# Altium schematic sheet CP2526_TOUCH.SchDoc
size A4
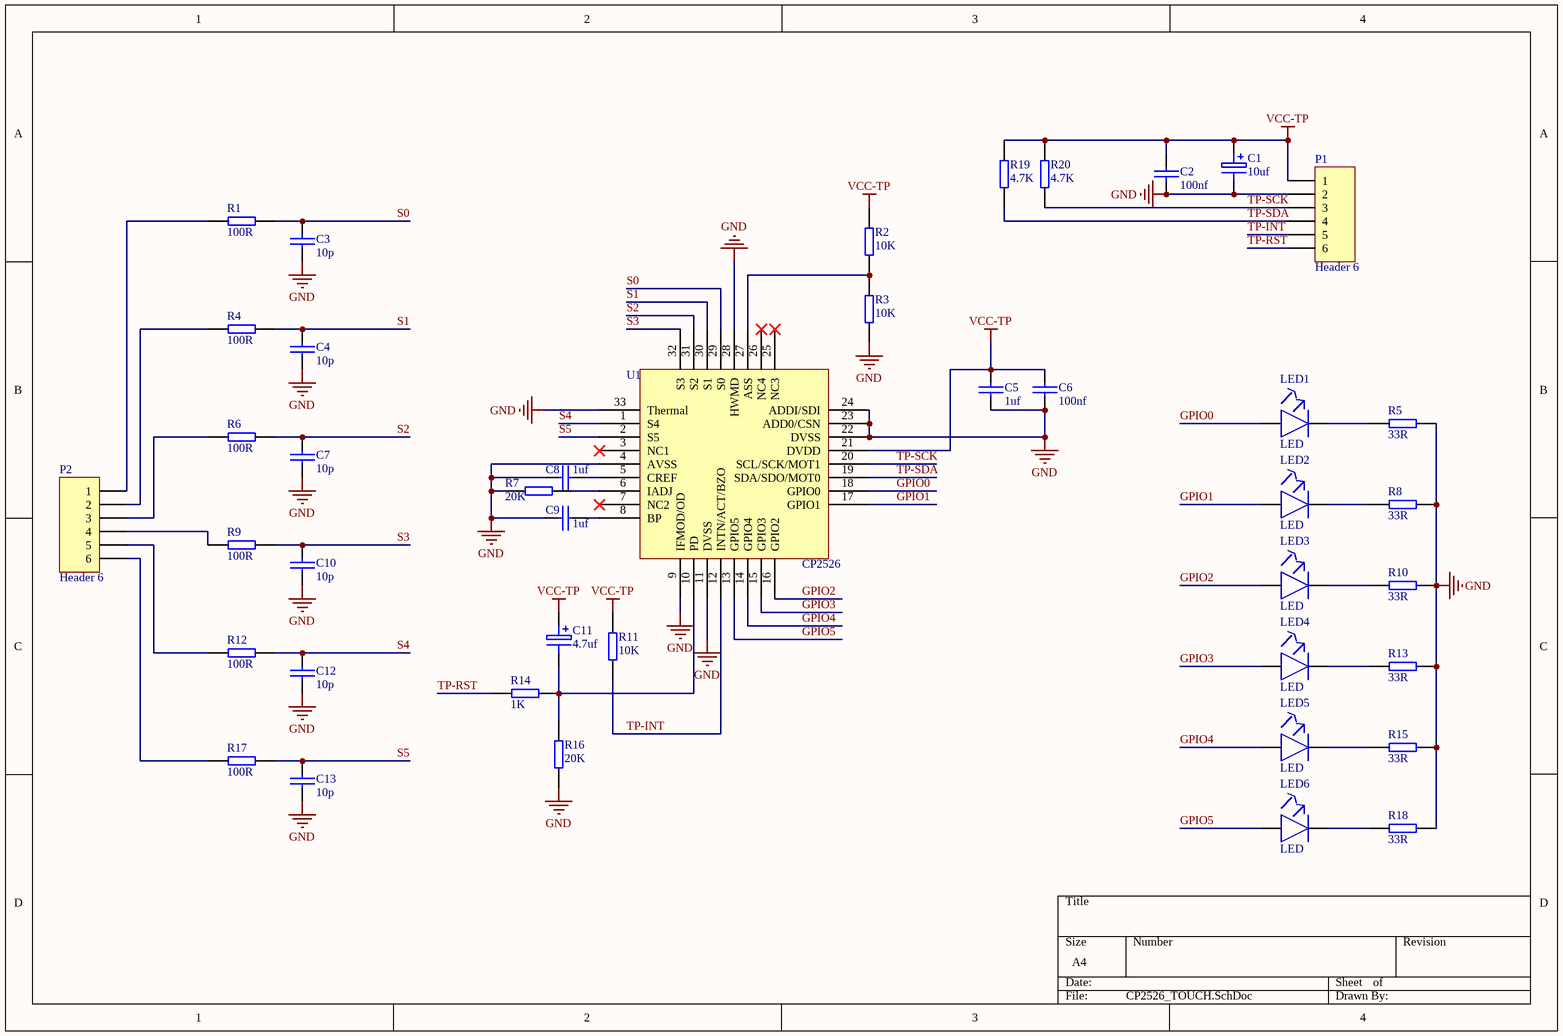
[diagram p0: CP2526_TOUCH.SchDoc]

## Parts
C1  10uf  [1206-C]
C2  100nf  [0603]
C3  10p  [0603]
C4  10p  [0603]
C5  1uf  [0603]
C6  100nf  [0603]
C7  10p  [0603]
C8  1uf  [0603]
C9  1uf  [0603]
C10  10p  [0603]
C11  4.7uf  [1206-C]
C12  10p  [0603]
C13  10p  [0603]
LED1  LED  [0603]
LED2  LED  [0603]
LED3  LED  [0603]
LED4  LED  [0603]
LED5  LED  [0603]
LED6  LED  [0603]
P1  Header 6  [HDR1X6]
P2  Header 6  [HDR1X6]
R1  100R  [0603]
R2  10K  [0603]
R3  10K  [0603]
R4  100R  [0603]
R5  33R  [0603]
R6  100R  [0603]
R7  20K  [0603]
R8  33R  [0603]
R9  100R  [0603]
R10  33R  [0603]
R11  10K  [0603]
R12  100R  [0603]
R13  33R  [0603]
R14  1K  [0603]
R15  33R  [0603]
R16  20K  [0603]
R17  100R  [0603]
R18  33R  [0603]
R19  4.7K  [0603]
R20  4.7K  [0603]
U1  CP2526  [LQFP32]

## Nets
GND: C1.2 C2.2 C3.2 C4.2 C5.2 C6.2 C7.2 C8.1 C9.1 C10.2 C12.2 C13.2 P1.2 R3.1 R5.2 R7.1 R8.2 R10.2 R13.2 R15.2 R16.1 R18.2 U1.4(AVSS) U1.9(IFMOD/OD) U1.11(DVSS) U1.22(DVSS) U1.23(ADD0/CSN) U1.24(ADDI/SDI) U1.28(HWMD) U1.33(Thermal)
VCC-TP: C1.1 C2.1 C5.1 C6.1 C11.1 P1.1 R2.2 R11.2 R19.2 R20.2 U1.21(DVDD)
GPIO0: LED1.1(+) U1.18(GPIO0)
GPIO1: LED2.1(+) U1.17(GPIO1)
GPIO2: LED3.1(+) U1.16(GPIO2)
GPIO3: LED4.1(+) U1.15(GPIO3)
GPIO4: LED5.1(+) U1.14(GPIO4)
GPIO5: LED6.1(+) U1.13(GPIO5)
S0: C3.1 R1.2 U1.29(S0)
S1: C4.1 R4.2 U1.30(S1)
S2: C7.1 R6.2 U1.31(S2)
S3: C10.1 R9.2 U1.32(S3)
S4: C12.1 R12.2 U1.1(S4)
S5: C13.1 R17.2 U1.2(S5)
TP-INT: P1.5 R11.1 U1.12(INTN/ACT/BZO)
TP-RST: P1.6 R14.1
TP-SCK: P1.3 R20.1 U1.20(SCL/SCK/MOT1)
TP-SDA: P1.4 R19.1 U1.19(SDA/SDO/MOT0)
NetC8_2: C8.2 U1.5(CREF)
NetC9_2: C9.2 U1.8(BP)
NetC11_2: C11.2 R14.2 R16.2 U1.10(PD)
NetLED1_2: LED1.2(-) R5.1
NetLED2_2: LED2.2(-) R8.1
NetLED3_2: LED3.2(-) R10.1
NetLED4_2: LED4.2(-) R13.1
NetLED5_2: LED5.2(-) R15.1
NetLED6_2: LED6.2(-) R18.1
NetP2_1: P2.1 R1.1
NetP2_2: P2.2 R4.1
NetP2_3: P2.3 R6.1
NetP2_4: P2.4 R9.1
NetP2_5: P2.5 R12.1
NetP2_6: P2.6 R17.1
NetR2_1: R2.1 R3.2 U1.27(ASS)
NetR7_2: R7.2 U1.6(IADJ)

Not connected (* = marked no-connect by the designer): U1 3(NC1)* 7(NC2)* 25(NC3)* 26(NC4)*

## Library data of the parts
C1 C11 = CAP2: Electrolytic Capacitor
C2-C10 C12 C13 = CAP: Capacitor
P1 P2 = Header 6: Header, 6-Pin; LatestRevisionDate: 17-Jul-2002; LatestRevisionNote: Re-released for DXP Platform.; Publisher: Altium Limited
R1-R20 = RES2